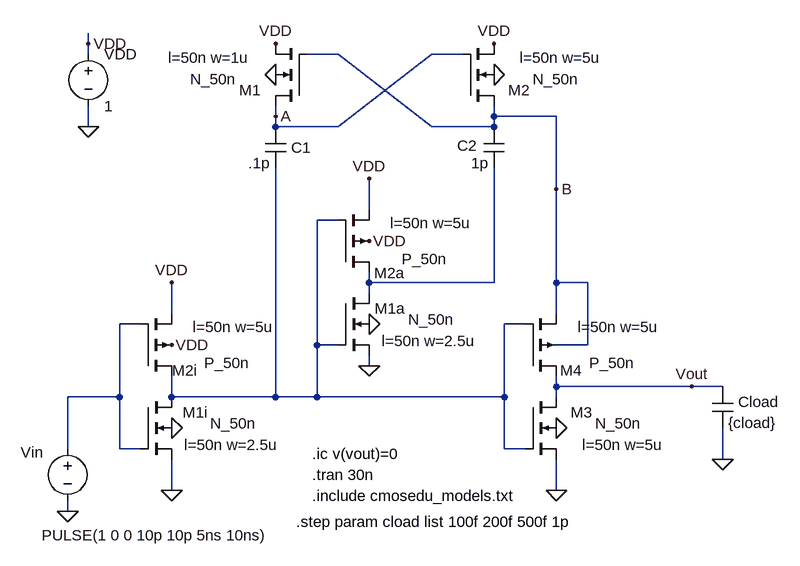
[diagram p0: schematic Fig18_39.asc]
Fig18_39.asc, the LTspice schematic file:
Version 4
SHEET 1 1616 680
WIRE 320 -720 320 -736
WIRE 320 -704 320 -720
WIRE 704 -704 656 -704
WIRE 896 -704 848 -704
WIRE 608 -608 608 -624
WIRE 944 -608 944 -624
WIRE 1040 -608 944 -608
WIRE 320 -592 320 -624
WIRE 608 -592 608 -608
WIRE 704 -592 848 -704
WIRE 704 -592 608 -592
WIRE 848 -592 704 -704
WIRE 944 -592 944 -608
WIRE 944 -592 848 -592
WIRE 1040 -496 1040 -608
WIRE 752 -464 752 -512
WIRE 704 -448 672 -448
WIRE 752 -352 752 -368
WIRE 944 -352 944 -528
WIRE 944 -352 752 -352
WIRE 1040 -352 1040 -496
WIRE 1088 -352 1040 -352
WIRE 752 -336 752 -352
WIRE 448 -304 448 -352
WIRE 1040 -304 1040 -352
WIRE 400 -288 368 -288
WIRE 992 -288 960 -288
WIRE 672 -256 672 -448
WIRE 704 -256 672 -256
WIRE 1088 -256 1088 -352
WIRE 1088 -256 1040 -256
WIRE 752 -224 752 -240
WIRE 1040 -192 1040 -208
WIRE 1248 -192 1040 -192
WIRE 1296 -192 1248 -192
WIRE 368 -176 368 -288
WIRE 368 -176 288 -176
WIRE 448 -176 448 -208
WIRE 608 -176 608 -528
WIRE 608 -176 448 -176
WIRE 672 -176 672 -256
WIRE 672 -176 608 -176
WIRE 960 -176 960 -288
WIRE 960 -176 672 -176
WIRE 1040 -176 1040 -192
WIRE 288 -96 288 -176
WIRE 368 -96 368 -176
WIRE 400 -96 368 -96
WIRE 960 -96 960 -176
WIRE 992 -96 960 -96
WIRE 1296 -80 1296 -128
WIRE 448 -32 448 -80
WIRE 1040 -32 1040 -80
WIRE 288 0 288 -16
FLAG 288 0 0
FLAG 448 -128 0
FLAG 320 -592 0
FLAG 320 -720 VDD
FLAG 448 -256 VDD
FLAG 448 -32 0
FLAG 448 -352 VDD
FLAG 1296 -80 0
FLAG 752 -288 0
FLAG 752 -416 VDD
FLAG 752 -224 0
FLAG 752 -512 VDD
FLAG 1040 -128 0
FLAG 1040 -32 0
FLAG 944 -672 0
FLAG 608 -672 0
FLAG 608 -720 VDD
FLAG 944 -720 VDD
FLAG 1248 -192 Vout
FLAG 608 -608 A
FLAG 1040 -496 B
SYMBOL nmos4 400 -176 R0
WINDOW 0 104 24 Right 2
WINDOW 3 179 41 Right 2
WINDOW 123 213 74 Right 2
SYMATTR InstName M1i
SYMATTR Value N_50n
SYMATTR Value2 l=50n w=2.5u
SYMBOL voltage 288 -112 R0
WINDOW 0 -72 21 Left 2
WINDOW 3 -40 149 Left 2
WINDOW 123 0 0 Left 2
WINDOW 39 0 0 Left 2
SYMATTR InstName Vin
SYMATTR Value PULSE(1 0 0 10p 10p 5ns 10ns)
SYMBOL voltage 320 -720 R0
WINDOW 123 0 0 Left 2
WINDOW 39 0 0 Left 2
SYMATTR InstName VDD
SYMATTR Value 1
SYMBOL pmos4 400 -208 M180
WINDOW 0 88 9 Right 2
WINDOW 3 168 20 Right 2
WINDOW 123 206 76 Right 2
SYMATTR InstName M2i
SYMATTR Value P_50n
SYMATTR Value2 l=50n w=5u
SYMBOL cap 1280 -192 R0
WINDOW 0 40 24 Left 2
SYMATTR InstName Cload
SYMATTR Value {cload}
SYMBOL cap 960 -528 R180
WINDOW 0 42 35 Left 2
WINDOW 3 24 8 Left 2
SYMATTR InstName C2
SYMATTR Value 1p
SYMBOL nmos4 704 -336 R0
WINDOW 0 104 24 Right 2
WINDOW 3 179 41 Right 2
WINDOW 123 213 74 Right 2
SYMATTR InstName M1a
SYMATTR Value N_50n
SYMATTR Value2 l=50n w=2.5u
SYMBOL pmos4 704 -368 M180
WINDOW 0 103 -1 Right 2
WINDOW 3 168 20 Right 2
WINDOW 123 206 76 Right 2
SYMATTR InstName M2a
SYMATTR Value P_50n
SYMATTR Value2 l=50n w=5u
SYMBOL nmos4 992 -176 R0
WINDOW 0 104 24 Right 2
WINDOW 3 179 41 Right 2
WINDOW 123 213 74 Right 2
SYMATTR InstName M3
SYMATTR Value N_50n
SYMATTR Value2 l=50n w=5u
SYMBOL pmos4 992 -208 M180
WINDOW 0 88 9 Right 2
WINDOW 3 168 20 Right 2
WINDOW 123 206 76 Right 2
SYMATTR InstName M4
SYMATTR Value P_50n
SYMATTR Value2 l=50n w=5u
SYMBOL cap 624 -528 R180
WINDOW 0 -39 32 Left 2
WINDOW 3 24 8 Left 2
SYMATTR InstName C1
SYMATTR Value .1p
SYMBOL nmos4 896 -624 M180
WINDOW 0 104 24 Right 2
WINDOW 3 179 41 Right 2
WINDOW 123 213 74 Right 2
SYMATTR InstName M2
SYMATTR Value N_50n
SYMATTR Value2 l=50n w=5u
SYMBOL nmos4 656 -624 R180
WINDOW 0 104 24 Right 2
WINDOW 3 179 41 Right 2
WINDOW 123 213 74 Right 2
SYMATTR InstName M1
SYMATTR Value N_50n
SYMATTR Value2 l=50n w=1u
TEXT 664 -56 Left 2 !.tran 30n
TEXT 664 -24 Left 2 !.include cmosedu_models.txt
TEXT 640 16 Left 2 !.step param cload list 100f 200f 500f 1p
TEXT 664 -88 Left 2 !.ic v(vout)=0

The netlist it stands for:
* Fig18_39.asc
M1i N001 N003 0 0 N_50n l=50n w=2.5u
Vin N003 0 PULSE(1 0 0 10p 10p 5ns 10ns)
VDD VDD 0 1
M2i N001 N003 VDD VDD P_50n l=50n w=5u
Cload Vout 0 {cload}
C2 N002 B 1p
M1a N002 N001 0 0 N_50n l=50n w=2.5u
M2a N002 N001 VDD VDD P_50n l=50n w=5u
M3 Vout N001 0 0 N_50n l=50n w=5u
M4 Vout N001 B B P_50n l=50n w=5u
C1 N001 A .1p
M2 B A VDD 0 N_50n l=50n w=5u
M1 A B VDD 0 N_50n l=50n w=1u
.model NMOS NMOS
.model PMOS PMOS
.lib standard.mos
.tran 30n
.include cmosedu_models.txt
.step param cload list 100f 200f 500f 1p
.ic v(vout)=0
.backanno
.end